# EAGLE design goodfet21 (EAGLE 5.06)
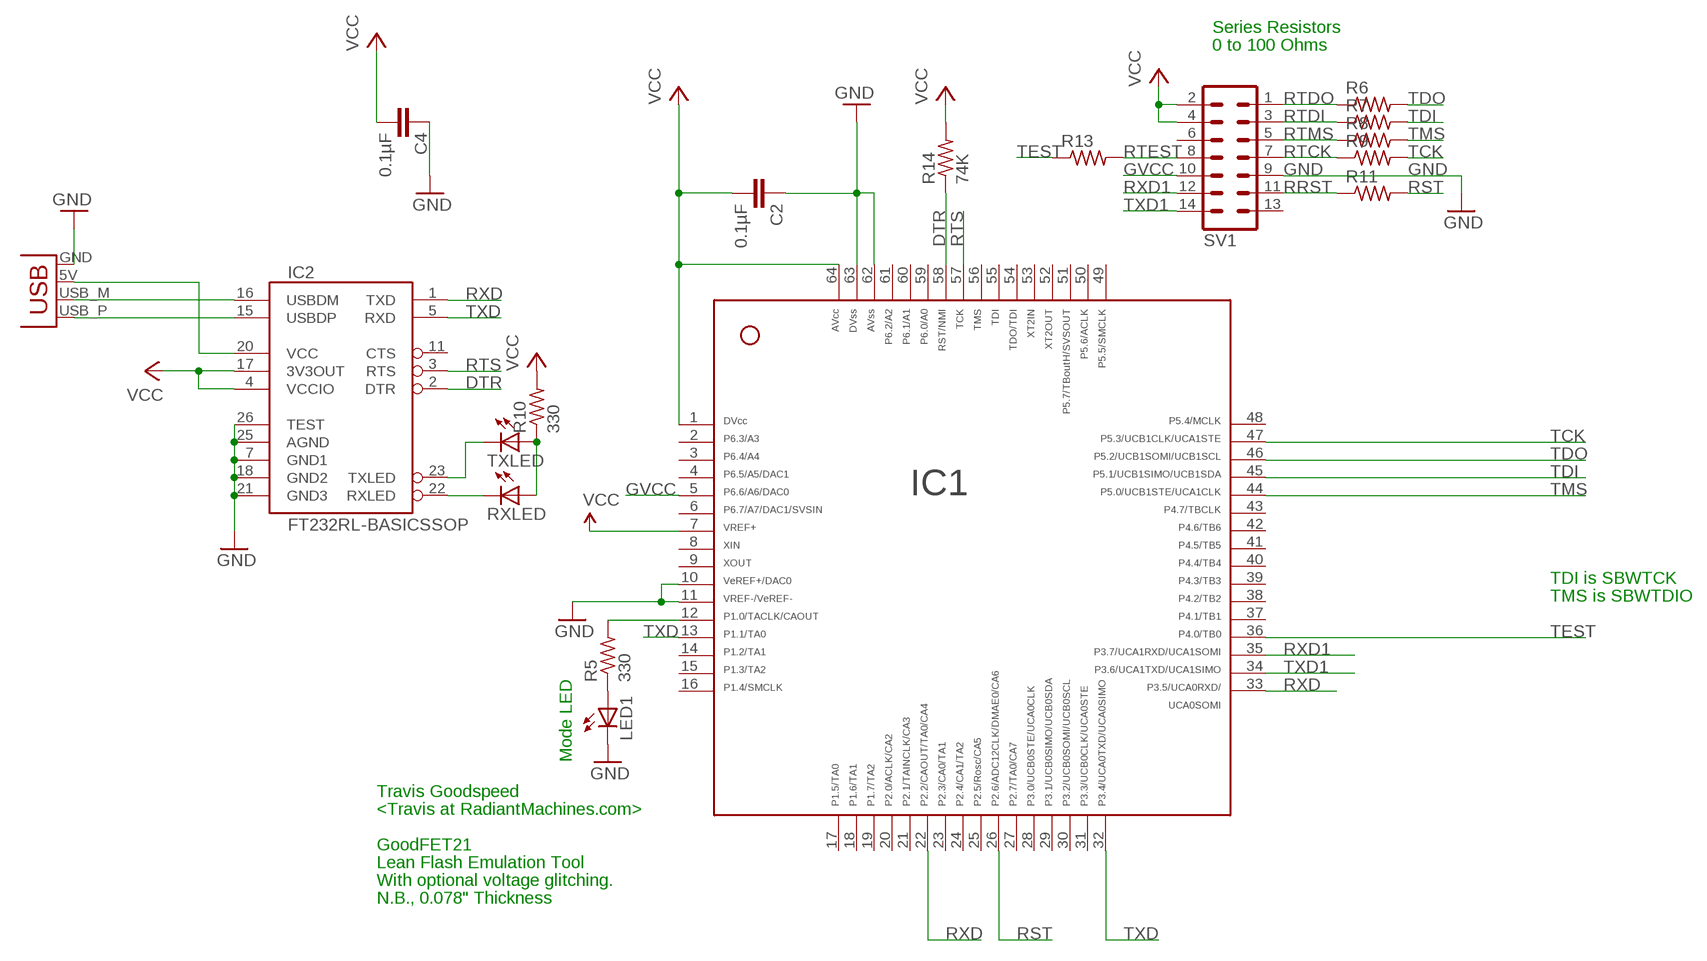
[diagram p0: schematic, sheet 1]

## Parts
C2  0.1µF  C-EUC0603  [C0603]
C4  0.1µF  C-EUC0603  [C0603]
IC1  F261X---PM64  [PM/PAG64]
IC2  FT232RL-BASICSSOP  [SSOP28DB]
LED1  LEDCHIP-LED0603  [CHIP-LED0603]
R5  330  R-US_R0603  [R0603]
R6  R-US_R0603  [R0603]
R7  R-US_R0603  [R0603]
R8  R-US_R0603  [R0603]
R9  R-US_R0603  [R0603]
R10  330  R-US_R0603  [R0603]
R11  R-US_R0603  [R0603]
R13  R-US_R0603  [R0603]
R14  74K  R-US_R0603  [R0603]
RXLED  LEDCHIP-LED0603  [CHIP-LED0603]
SV1  MA07-2  [MA07-2]
TXLED  LEDCHIP-LED0603  [CHIP-LED0603]
X1  USBPCB  [USB-A-PCB]

## Nets
DTR: IC1.58 IC2.2(DTR) R14.1
GND: C2.1 C4.1 IC1.10 IC1.11 IC1.62 IC1.63 IC2.7(GND1) IC2.18(GND2) IC2.21(GND3) IC2.25(AGND) IC2.26(TEST) LED1.C SV1.9 X1.GND
GVCC: IC1.5 SV1.10
N$1: IC1.12 R5.2
N$2: LED1.A R5.1
N$3: IC2.15(USBDP) X1.USB_P(D+)
N$4: IC2.16(USBDM) X1.USB_M(D-)
N$5: IC2.20(VCC) X1.5V(VBUS)
N$6: IC2.22(RXLED) RXLED.C
N$7: IC2.23(TXLED) TXLED.C
N$8: R10.1 RXLED.A TXLED.A
RRST: R11.1 SV1.11
RST: IC1.26 R11.2
RTCK: R9.1 SV1.7
RTDI: R7.1 SV1.3
RTDO: R6.1 SV1.1
RTEST: R13.2 SV1.8
RTMS: R8.1 SV1.5
RTS: IC1.57 IC2.3(RTS)
RXD: IC1.22 IC1.33 IC2.1(TXD)
RXD1: IC1.35 SV1.12
TCK: IC1.47 R9.2
TDI: IC1.45 R7.2
TDO: IC1.46 R6.2
TEST: IC1.36 R13.1
TMS: IC1.44 R8.2
TXD: IC1.13 IC1.32 IC2.5(RXD)
TXD1: IC1.34 SV1.14
VCC: C2.2 C4.2 IC1.1 IC1.7 IC1.64 IC2.4(VCCIO) IC2.17(3V3OUT) R10.2 R14.2 SV1.2 SV1.4
Unconnected: IC1.2 IC1.3 IC1.4 IC1.6 IC1.8 IC1.9 IC1.14 IC1.15 IC1.16 IC1.17 IC1.18 IC1.19 IC1.20 IC1.21 IC1.23 IC1.24 IC1.25 IC1.27 IC1.28 IC1.29 IC1.30 IC1.31 IC1.37 IC1.38 IC1.39 IC1.40 IC1.41 IC1.42 IC1.43 IC1.48 IC1.49 IC1.50 IC1.51 IC1.52 IC1.53 IC1.54 IC1.55 IC1.56 IC1.59 IC1.60 IC1.61 IC2.11(CTS) SV1.6 SV1.13

## Notes on the sheet
- Series Resistors
- 0 to 100 Ohms
- TDI is SBWTCK
- TMS is SBWTDIO
- Mode LED
- Travis Goodspeed
- <Travis at RadiantMachines.com>
- GoodFET21
- Lean Flash Emulation Tool
- With optional voltage glitching.
- N.B., 0.078" Thickness

## Library data of the parts
C2 C4 = rcl:C-EU: CAPACITOR, European symbol
IC1 = TI_MSP430_v13:F261X---PM64: ***MSP430F261x***PM64
IC2 = SparkFun:FT232RL-BASIC: USB UART This is the simplified version of the FT232RL unit. Only what you need, nothing you don't. Spark Fun Electronics SKU : COM-00650
LED1 RXLED TXLED = led:LED: LED OSRAM: - CHIPLED LG R971, LG N971, LY N971, LG Q971, LY Q971, LO R971, LY R971 LH N974, LH R974 LS Q976, LO Q976, LY Q976 LO Q996 - Hyper CHIPLED LW Q18S LB Q993, LB Q99A, LB R99A - SideLED LS A670, LO A670, LY A670, LG A670, LP A670 LB A673, LV A673, LT A673, LW A673 LH A674 LY A675 LS A676, LA A676, LO A676, LY A676, LW A676 LS A679, LY A679, LG A679 - Hyper Micro SIDELED® LS Y876, LA Y876, LO Y876, LY Y876 LT Y87S - SmartLED LW L88C, LW L88S LB L89C, LB L89S, LG L890 LS L89K, LO L89K, LY L89K LS L896, LA L896, LO L896, LY L896 - TOPLED LS T670, LO T670, LY T670, LG T670, LP T670 LSG T670, LSP T670, LSY T670, LOP T670, LYG T670 LG T671, LOG T671, LSG T671 LB T673, LV T673, LT T673, LW T673 LH T674 LS T676, LA T676, LO T676, LY T676, LB T676, LH T676, LSB T676, LW T676 LB T67C, LV T67C, LT T67C, LS T67K, LO T67K, LY T67K, LW E67C LS E67B, LA E67B, LO E67B, LY E67B, LB E67C, LV E67C, LT E67C LW T67C LS T679, LY T679, LG T679 LS T770, LO T770, LY T770, LG T770, LP T770 LB T773, LV T773, LT T773, LW T773 LH T774 LS E675, LA E675, LY E675, LS T675 LS T776, LA T776, LO T776, LY T776, LB T776 LHGB T686 LT T68C, LB T68C - Hyper Mini TOPLED® LB M676 - Mini TOPLED Santana® LG M470 LS M47K, LO M47K, LY M47K Source: http://www.osram.convergy.de LUXEON: - LUMILED® LXK2-PW12-R00, LXK2-PW12-S00, LXK2-PW14-U00, LXK2-PW14-V00 LXK2-PM12-R00, LXK2-PM12-S00, LXK2-PM14-U00 LXK2-PE12-Q00, LXK2-PE12-R00, LXK2-PE12-S00, LXK2-PE14-T00, LXK2-PE14-U00 LXK2-PB12-K00, LXK2-PB12-L00, LXK2-PB12-M00, LXK2-PB14-N00, LXK2-PB14-P00, LXK2-PB14-Q00 LXK2-PR12-L00, LXK2-PR12-M00, LXK2-PR14-Q00, LXK2-PR14-R00 LXK2-PD12-Q00, LXK2-PD12-R00, LXK2-PD12-S00 LXK2-PH12-R00, LXK2-PH12-S00 LXK2-PL12-P00, LXK2-PL12-Q00, LXK2-PL12-R00 Source: www.luxeon.com KINGBRIGHT: KA-3528ASYC Source: www.kingbright.com
R5 R10 R14 = rcl:R-US_: RESISTOR, American symbol
R6-R9 R11 R13 = resistor:R-US_: RESISTOR, American symbol
SV1 = con-lstb:MA07-2: PIN HEADER
X1 = SparkFun:USB: USB Connectors USB-B-PTH is fully proven SKU : PRT-00139 USB-miniB is fully proven SKU : PRT-00587 USB-A-PCB is untested. USB-A-H is throughly reviewed, but untested. Spark Fun Electronics SKU : PRT-00437 USB-B-SMT is throughly reviewed, but untested. Needs silkscreen touching up. USB-A-S has not been used/tested USB-MB-H has not been used/tested

## Board
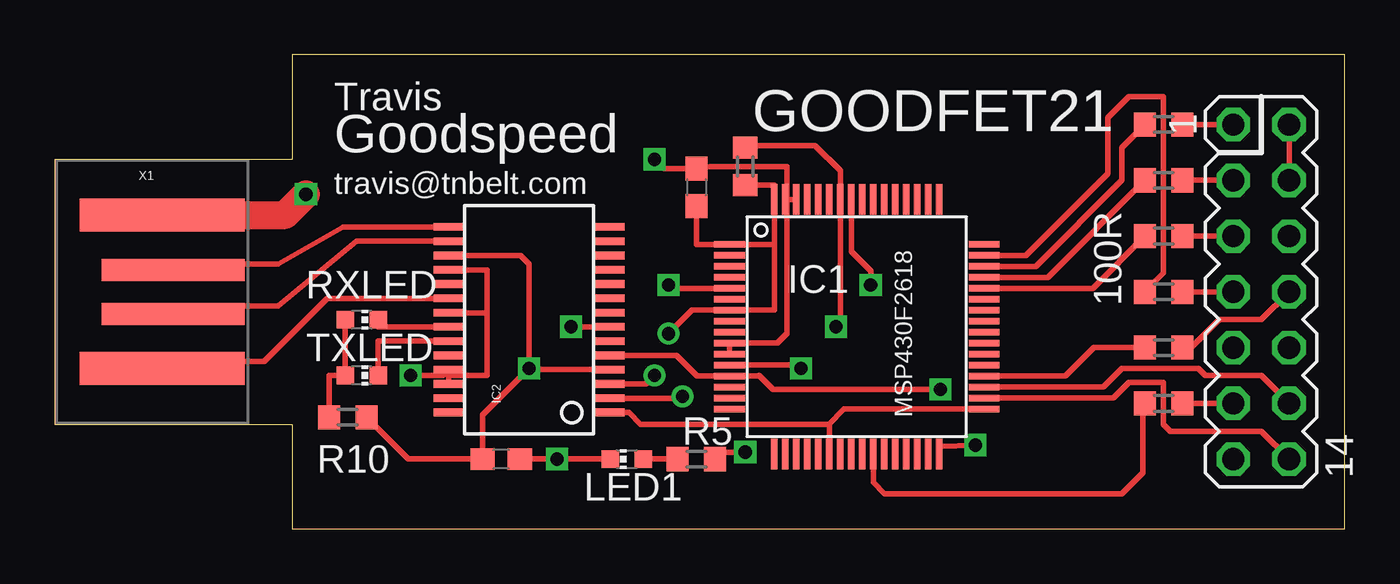
[diagram p1: board, top side]
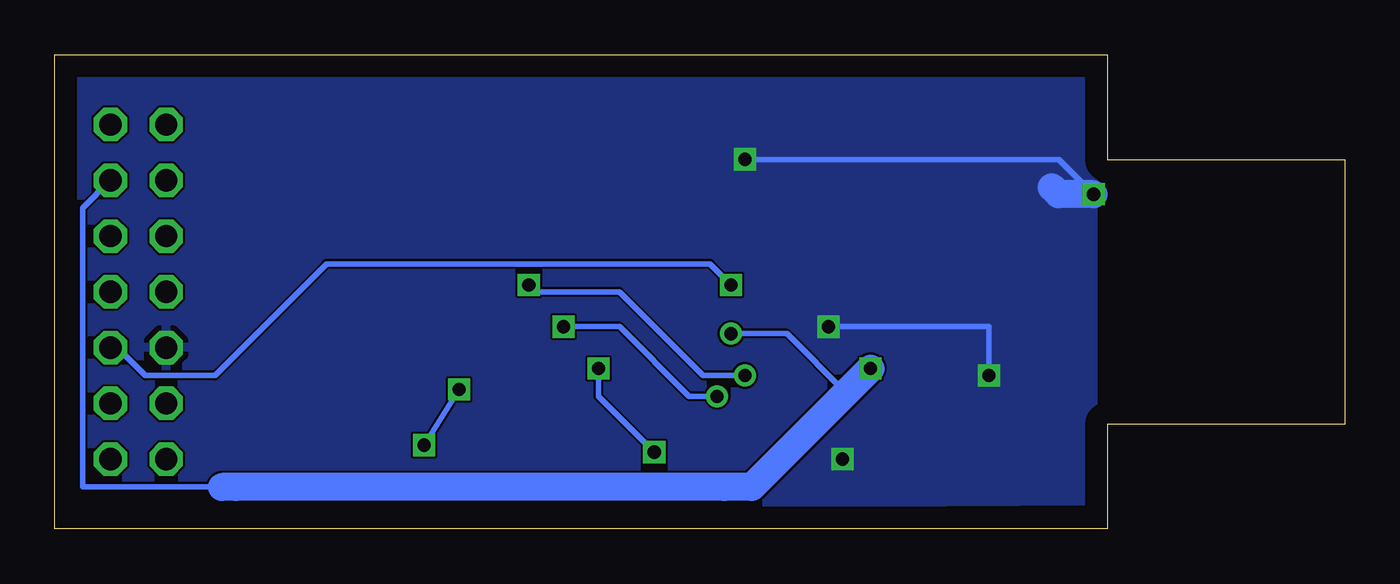
[diagram p2: board, bottom side, seen from below]

Size 58.73 x 21.59 mm. Coordinates in mm from the lower left corner, seen from the top.
Outline: 10.79,0 58.73,0 58.73,21.59 10.79,21.59 10.79,16.83 0,16.83 0,4.76 10.79,4.76 10.79,0
Copper layers (1*16): Top 0.035mm / dielectric 1.5mm / Bottom 0.035mm
Design rules "default *": minimum track width 10mil, minimum drill 8mil, track to track 4mil, track to pad 8mil, pad to pad 4mil, via to via 8mil, smd to smd 8mil, copper to edge 40mil, drill to drill 8mil, minimum pad ring 10mil, minimum via ring 8mil, stop-mask expansion 4mil, vias tented up to drill 0mil, thermal gap 10mil

### Footprints (pad centres in the part's own frame; a part is rotated, then mirrored left to right if it is on the bottom)
C0603 = smd 1.1 x 1: 1 -0.85,0; 2 0.85,0
PM/PAG64 = smd 1.4 x 0.3: 1 -5.8,3.75; 2 -5.8,3.25; 3 -5.8,2.75; 4 -5.8,2.25; 5 -5.8,1.75; 6 -5.8,1.25; 7 -5.8,0.75; 8 -5.8,0.25; 9 -5.8,-0.25; 10 -5.8,-0.75; 11 -5.8,-1.25; 12 -5.8,-1.75; 13 -5.8,-2.25; 14 -5.8,-2.75; 15 -5.8,-3.25; 16 -5.8,-3.75; 33 5.8,-3.75; 34 5.8,-3.25; 35 5.8,-2.75; 36 5.8,-2.25; 37 5.8,-1.75; 38 5.8,-1.25; 39 5.8,-0.75; 40 5.8,-0.25; 41 5.8,0.25; 42 5.8,0.75; 43 5.8,1.25; 44 5.8,1.75; 45 5.8,2.25; 46 5.8,2.75; 47 5.8,3.25; 48 5.8,3.75 | smd 0.3 x 1.4: 17 -3.75,-5.8; 18 -3.25,-5.8; 19 -2.75,-5.8; 20 -2.25,-5.8; 21 -1.75,-5.8; 22 -1.25,-5.8; 23 -0.75,-5.8; 24 -0.25,-5.8; 25 0.25,-5.8; 26 0.75,-5.8; 27 1.25,-5.8; 28 1.75,-5.8; 29 2.25,-5.8; 30 2.75,-5.8; 31 3.25,-5.8; 32 3.75,-5.8; 49 3.75,5.8; 50 3.25,5.8; 51 2.75,5.8; 52 2.25,5.8; 53 1.75,5.8; 54 1.25,5.8; 55 0.75,5.8; 56 0.25,5.8; 57 -0.25,5.8; 58 -0.75,5.8; 59 -1.25,5.8; 60 -1.75,5.8; 61 -2.25,5.8; 62 -2.75,5.8; 63 -3.25,5.8; 64 -3.75,5.8
SSOP28DB = smd 0.348 x 1.397: 1 -4.225,-3.656; 2 -3.575,-3.656; 3 -2.925,-3.656; 4 -2.275,-3.656; 5 -1.625,-3.656; 6 -0.975,-3.656; 7 -0.325,-3.656; 8 0.325,-3.656; 9 0.975,-3.656; 10 1.625,-3.656; 11 2.275,-3.656; 12 2.925,-3.656; 13 3.575,-3.656; 14 4.225,-3.656; 15 4.225,3.656; 16 3.575,3.656; 17 2.925,3.656; 18 2.275,3.656; 19 1.625,3.656; 20 0.975,3.656; 21 0.325,3.656; 22 -0.325,3.656; 23 -0.975,3.656; 24 -1.625,3.656; 25 -2.275,3.656; 26 -2.925,3.656; 27 -3.575,3.656; 28 -4.225,3.656
CHIP-LED0603 = smd 0.8 x 0.8: A 0,-0.75; C 0,0.75
R0603 = smd 1 x 1.1: 1 -0.85,0; 2 0.85,0
MA07-2 = drill 1.016 octagon: 1 -7.62,-1.27; 2 -7.62,1.27; 3 -5.08,-1.27; 4 -5.08,1.27; 5 -2.54,-1.27; 6 -2.54,1.27; 7 0,-1.27; 8 0,1.27; 9 2.54,-1.27; 10 2.54,1.27; 11 5.08,-1.27; 12 5.08,1.27; 13 7.62,-1.27; 14 7.62,1.27
USB-A-PCB = smd 7.5 x 1.5: 5V -0.2,-3.5; GND -0.2,3.5 | smd 6.5 x 1: USB_M 0.3,-1; USB_P 0.3,1

### Placement (x,y rotation side)
C2  29.21,15.56 270 top
C4  20.32,3.18 180 top
IC1  36.51,9.21 0 top
IC2  21.59,9.53 90 top
LED1  26.04,3.18 90 top
R5  29.21,3.18 0 top
R6  50.48,18.42 180 top
R7  50.48,15.88 180 top
R8  50.48,13.33 180 top
R9  50.48,10.79 180 top
R10  13.33,5.08 0 top
R11  50.48,5.71 180 top
R13  50.48,8.25 0 top
R14  31.43,16.51 270 top
RXLED  13.97,9.53 270 top
SV1  54.93,10.79 270 top
TXLED  13.97,6.99 270 top
X1  5.08,10.79 0 top

### Tracks (layer width: path | path; a pad name or v marks a point on that pad's centre or on a via)
DTR  (via drill 0.6)
  Top 0.254: R14.1 31.54,17.46 34.61,17.46 35.76,16.31 IC1.58 35.76,9.41 v35.56,9.21 | IC2.2 28.49,5.95 v28.57,6.03
  Bottom 0.254: v28.57,6.03 29.85,6.03 33.02,9.21 v35.56,9.21
GND  (via drill 0.6)
  Top 0.254: v22.86,3.18 C4.1 v22.86,3.18 | v22.86,3.18 LED1.C | IC2.26 IC2.25 | IC2.25 17.67,6.99 v16.19,6.99 | IC2.18 19.68,11.8 19.68,10.16 | 19.68,10.16 19.68,6.99 17.93,6.99 IC2.25 | IC2.21 17.46,9.85 17.46,9.84 19.68,9.84 19.68,10.16 | IC2.7 23.18,9.2 v23.49,9.21 | IC1.11 IC1.10 32.91,8.46 33.34,8.89 33.34,14.93 IC1.63 | IC1.63 IC1.62 | IC1.63 33.34,15.01 33.34,16.51 29.85,16.51 C2.1 27.72,16.41 v27.3,16.83
  Top 1.27: X1.GND 10.48,14.29 v11.43,15.24
  Bottom 0.254: 16.51,6.99 v16.19,6.99 16.19,9.21 v23.49,9.21 | v27.3,16.83 13.02,16.83 v11.43,15.24
  Bottom 1.27: v11.43,15.24 13.02,15.24 13.33,15.56
  pour Bottom: 11.75,20.96 58.1,20.64 58.42,0.95 11.43,1.27 11.43,20.64
GVCC  (via drill 0.6)
  Top 0.254: IC1.5 28.1,10.96 v27.94,11.11
  Bottom 0.254: v27.94,11.11 28.89,12.07 46.36,12.07 51.44,6.99 54.61,6.99 55.88,8.25 SV1.10
N$1  (via drill 0.6)
  Top 0.254: IC1.12 33.82,7.46 v33.97,7.3 | v31.43,3.49 30.38,3.49 R5.2
  Bottom 0.254: v33.97,7.3 33.97,6.03 v31.43,3.49
N$2
  Top 0.254: LED1.A R5.1
N$3
  Top 0.254: IC2.15 13.11,13.75 10.16,12.07 5.65,12.07 X1.USB_P
N$4
  Top 0.254: IC2.16 13.73,13.1 10.16,10.16 5.75,10.16 X1.USB_M
N$5
  Top 0.254: IC2.20 12.4,10.5 9.52,7.62 5.2,7.62 X1.5V
N$6
  Top 0.254: IC2.22 14.72,9.2 RXLED.C
N$7
  Top 0.254: IC2.23 14.72,8.55 TXLED.C
N$8
  Top 0.254: RXLED.A TXLED.A 12.48,6.99 R10.1
RRST
  Top 0.254: R11.1 SV1.11
RST
  Top 0.254: IC1.26 37.26,2.11 37.78,1.59 48.58,1.59 49.53,2.54 49.53,5.61 R11.2
RTCK
  Top 0.254: R9.1 SV1.7
RTDI
  Top 0.254: R7.1 SV1.3
RTDO
  Top 0.254: R6.1 SV1.1
RTEST
  Top 0.254: R13.2 51.75,8.25 53.02,9.53 54.93,9.53 SV1.8
RTMS
  Top 0.254: R8.1 SV1.5
RTS  (via drill 0.6)
  Top 0.254: IC2.3 26.92,6.6 v27.3,6.99 | v37.15,11.11 37.15,11.75 36.26,12.63 IC1.57
  Bottom 0.254: v27.3,6.99 29.21,6.99 33.02,10.79 36.83,10.79 v37.15,11.11
RXD
  Top 0.254: IC2.1 26.13,5.3 26.67,4.76 35.24,4.76 | IC1.22 35.26,4.74 35.24,4.76 | IC1.33 35.94,5.46 35.24,4.76
RXD1
  Top 0.254: IC1.35 47.73,6.46 48.58,7.3 52.07,7.3 52.39,6.99 54.93,6.99 SV1.12
TCK
  Top 0.254: 49.85,10.79 R9.2 50.48,11.64 50.48,19.68 48.9,19.68 47.94,18.73 47.94,16.19 44.21,12.46 IC1.47
TDI
  Top 0.254: IC1.45 45.22,11.46 R7.2
TDO
  Top 0.254: IC1.46 44.66,11.96 48.58,15.88 48.58,17.36 R6.2
TEST
  Top 0.254: IC1.36 46.01,6.96 47.31,8.25 R13.1
TMS
  Top 0.254: IC1.44 47.26,10.96 R8.2
TXD  (via drill 0.6)
  Top 0.254: IC2.5 28.29,7.9 29.24,6.96 IC1.13 32.04,6.96 32.07,6.99 32.7,6.35 v40.32,6.35 | IC1.32 40.26,3.75 v41.91,3.81
  Bottom 0.254: v40.32,6.35 v41.91,3.81
TXD1
  Top 0.254: IC1.34 48.19,5.96 48.9,6.67 50.48,6.67 50.48,4.76 50.8,4.45 54.93,4.45 SV1.14
VCC  (via drill 0.6)
  Top 0.254: SV1.4 SV1.2 | C2.2 29.21,12.96 IC1.1 32.76,12.96 | v21.59,7.3 21.59,7.25 | IC2.17 21.2,12.45 21.59,12.07 v21.59,7.3 | v21.59,7.3 19.47,5.18 C4.2 16.09,3.18 R10.2 | 32.76,12.96 IC1.64 32.76,15.66 R14.2 | 32.76,12.96 32.76,9.96 IC1.7 29.01,9.96 v27.94,8.89 | IC2.4 21.64,7.25 v21.59,7.3
  Bottom 0.254: 28.26,1.91 27.94,2.22 | v27.94,8.89 25.4,8.89 22.7,6.19 | SV1.4 57.47,14.61 57.47,1.91 50.48,1.91
  Bottom 1.27: v21.59,7.3 22.7,6.19 26.99,1.91 28.26,1.91 50.48,1.91 51.12,1.91

### Text on the board
tPlace: Travis | GOODFET21 | Goodspeed | travis@tnbelt.com | 100R
tNames: MSP430F2618